# Altium schematic sheet AD5940PSTAT.SchDoc
size A; SheetNumber: 1; SheetTotal: 3
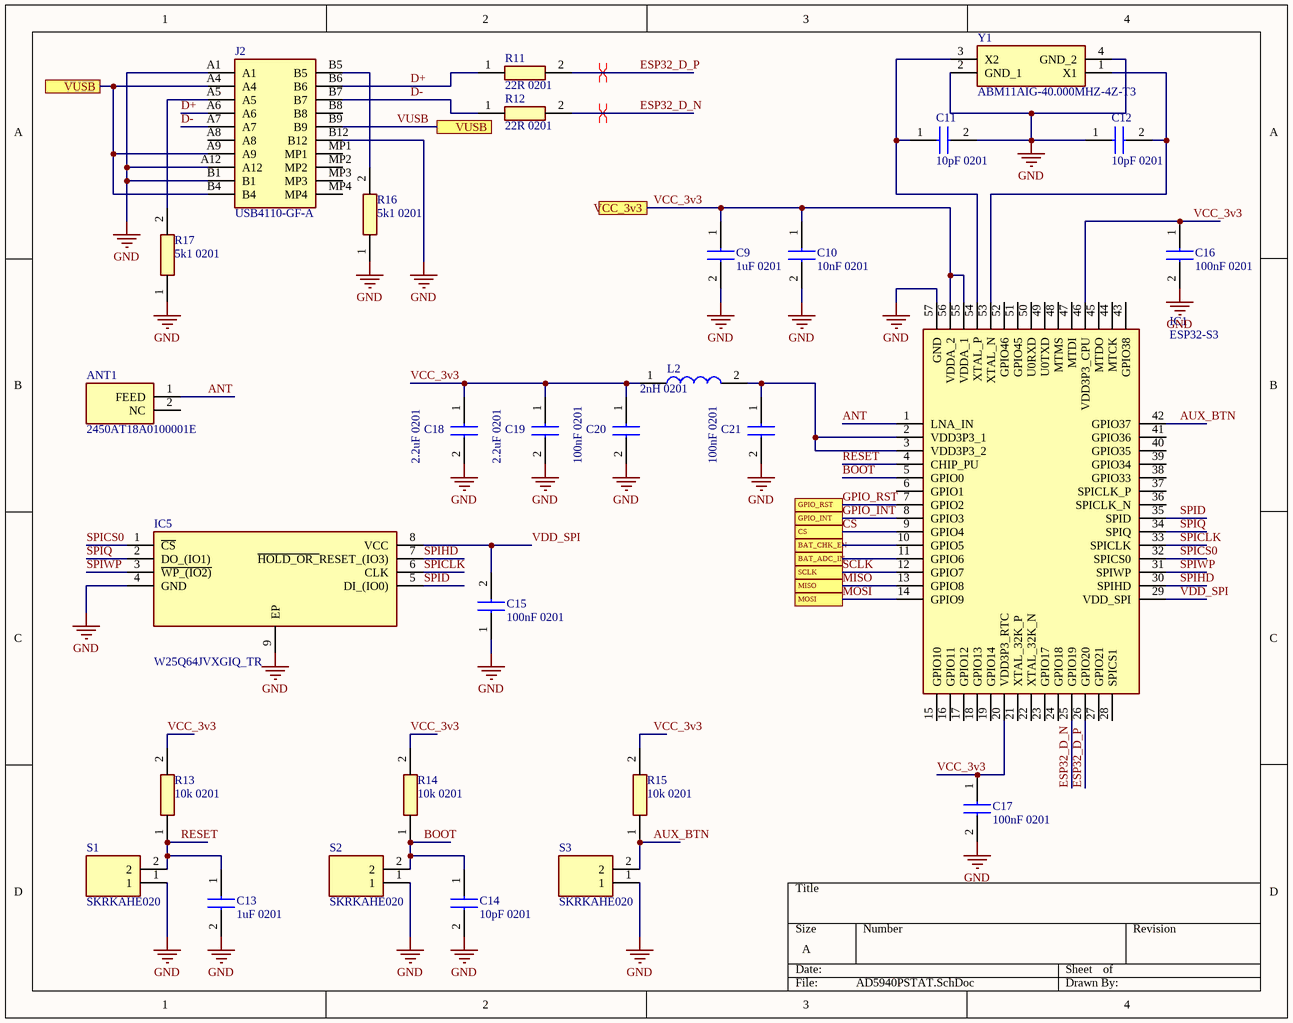
[diagram p0: AD5940PSTAT.SchDoc]

## Parts
ANT1  2450AT18A0100001E  [2450AT18A0100001E]
C9  1uF 0201  [CAPC0603X33N]
C10  10nF 0201  [CAPC0603X33N]
C11  10pF 0201  [CAPC0603X33N]
C12  10pF 0201  [CAPC0603X33N]
C13  1uF 0201  [CAPC0603X33N]
C14  10pF 0201  [CAPC0603X33N]
C15  100nF 0201  [CAPC0603X33N]
C16  100nF 0201  [CAPC0603X33N]
C17  100nF 0201  [CAPC0603X33N]
C18  2.2uF 0201  [CAPC0603X33N]
C19  2.2uF 0201  [CAPC0603X33N]
C20  100nF 0201  [CAPC0603X33N]
C21  100nF 0201  [CAPC0603X33N]
IC1  ESP32-S3  [QFN40P700X700X90-57N-D]
IC5  W25Q64JVXGIQ_TR  [SON80P400X400X50-9N]
J2  USB4110-GF-A  [USB4110GFA]
L2  2nH 0201  [LQP03TG3N1B02D]
R11  22R 0201  [RESC0603X28N]
R12  22R 0201  [RESC0603X28N]
R13  10k 0201  [RESC0603X28N]
R14  10k 0201  [RESC0603X28N]
R15  10k 0201  [RESC0603X28N]
R16  5k1 0201  [RESC0603X28N]
R17  5k1 0201  [RESC0603X28N]
S1  SKRKAHE020  [SKRKAEE020]
S2  SKRKAHE020  [SKRKAEE020]
S3  SKRKAHE020  [SKRKAEE020]
Y1  ABM11AIG-40.000MHZ-4Z-T3  [ABM11AIG16000MHZ81ZT]

## Ports
BAT_ADC_IN (see Battery_MGMT[4B]), BAT_CHK_EN (see Battery_MGMT[3B]), CS (see AD5940[4B]), GPIO_INT (see AD5940[4B]), GPIO_RST (see AD5940[4B]), MISO (see AD5940[4B]), MOSI (see AD5940[4B]), SCLK (see AD5940[4B]), VCC_3v3 (see Battery_MGMT[4C]), VUSB (see AD5940PSTAT[1A], Battery_MGMT[1C]), VUSB (see AD5940PSTAT[2A], Battery_MGMT[1C])

## Nets
GND: C9.2 C10.2 C11.2 C12.1 C13.2 C14.2 C15.1 C16.2 C17.2 C18.2 C19.2 C20.2 C21.2 IC1.57(GND) IC5.4(GND) IC5.9(EP) J2.A1 J2.A12 J2.B1 J2.B12 R16.1 R17.1 S1.1 S2.1 S3.1 Y1.2(GND_1) Y1.4(GND_2)
\: C14.1 IC1.5(GPIO0) R14.1 S2.2  [also labelled BOOT]
ANT: ANT1.1(FEED) IC1.1(LNA_IN)
AUX_BTN: IC1.42(GPIO37) R15.1 S3.2
BAT_ADC_IN: IC1.11(GPIO6) ; port BAT_ADC_IN
BAT_CHK_EN: IC1.10(GPIO5) ; port BAT_CHK_EN
CS: IC1.9(GPIO4) ; port CS
D+: J2.A6 J2.B6 R11.1
D-: J2.A7 J2.B7 R12.1
ESP32_D_N: IC1.25(GPIO19) R12.2
ESP32_D_P: IC1.26(GPIO20) R11.2
GPIO_INT: IC1.8(GPIO3) ; port GPIO_INT
GPIO_RST: IC1.7(GPIO2) ; port GPIO_RST
MISO: IC1.13(GPIO8) ; port MISO
MOSI: IC1.14(GPIO9) ; port MOSI
RESET: C13.1 IC1.4(CHIP_PU) R13.1 S1.2
SCLK: IC1.12(GPIO7) ; port SCLK
SPICLK: IC1.33(SPICLK) IC5.6(CLK)
SPICS0: IC1.32(SPICS0) IC5.1(~{CS})
SPID: IC1.35(SPID) IC5.5(DI_(IO0))
SPIHD: IC1.30(SPIHD) IC5.7(~{HOLD_OR_}RESET_(IO3))
SPIQ: IC1.34(SPIQ) IC5.2(DO_(IO1))
SPIWP: IC1.31(SPIWP) IC5.3(~{WP_(IO2)})
VCC_3v3: C9.1 C10.1 C16.1 C17.1 C18.1 C19.1 C20.1 IC1.20(VDD3P3_RTC) IC1.46(VDD3P3_CPU) IC1.55(VDDA_1) IC1.56(VDDA_2) L2.1 R13.2 R14.2 R15.2 ; port VCC_3v3
VDD_SPI: C15.2 IC1.29(VDD_SPI) IC5.8(VCC)
VUSB: J2.A4 J2.A9 J2.B4 J2.B9 ; port VUSB
NetC11_1: C11.1 IC1.54(XTAL_P) Y1.3(X2)
NetC12_2: C12.2 IC1.53(XTAL_N) Y1.1(X1)
NetC21_1: C21.1 IC1.2(VDD3P3_1) IC1.3(VDD3P3_2) L2.2
NetJ2_A5: J2.A5 R17.2
NetJ2_B5: J2.B5 R16.2

Not connected (* = marked no-connect by the designer): ANT1 2(NC); IC1 6(GPIO1) 15(GPIO10) 16(GPIO11) 17(GPIO12) 18(GPIO13) 19(GPIO14) 21(XTAL_32K_P) 22(XTAL_32K_N) 23(GPIO17) 24(GPIO18) 27(GPIO21) 28(SPICS1) 36(SPICLK_N) 37(SPICLK_P) 38(GPIO33) 39(GPIO34) 40(GPIO35) 41(GPIO36) 43(GPIO38) 44(MTCK) 45(MTDO) 47(MTDI) 48(MTMS) 49(U0TXD) 50(U0RXD) 51(GPIO45) 52(GPIO46); J2 A8 B8 MP1 MP2 MP3 MP4

## Layout directives
differential pair: ESP32_D_N, ESP32_D_P

## Library data of the parts
ANT1 = 2450AT18A0100001E: Antenna; Manufacturer_Name: JOHANSON TECHNOLOGY; Datasheet Link: https://www.johansontechnology.com/datasheets/2450AT18A100/2450AT18A100.pdf; Height: 1.4mm; Manufacturer_Part_Number: 2450AT18A0100001E
C9-C21 = 02013A0R5BAT2A: Capacitor; Manufacturer_Name: Kyocera AVX; Datasheet Link: http://www.mouser.com/catalog/supplier/library/pdf/AVXSurfaceMountCeramic.pdf; Height: 0.33mm; Manufacturer_Part_Number: 02013A0R5BAT2A; Mouser Part Number: 581-02013A0R5BAT2A; Mouser Price/Stock: https://www.mouser.co.uk/ProductDetail/KYOCERA-AVX/02013A0R5BAT2A?qs=Thry1QCnmXDPtFIq9lj3NA%3D%3D
IC1 = ESP32-S3: Integrated Circuit; Manufacturer_Name: Espressif Systems; Datasheet Link: https://nl.mouser.com/datasheet/2/891/Espressif_ESP32_S3_Datasheet-2904763.pdf; Height: 0.9mm; Manufacturer_Part_Number: ESP32-S3; Mouser Part Number: 356-ESP32-S3; Mouser Price/Stock: https://www.mouser.co.uk/ProductDetail/Espressif-Systems/ESP32-S3?qs=Rp5uXu7WBW%2FNWuUy%252BBihNw%3D%3D
IC5 = W25Q64JVXGIQ_TR: Integrated Circuit; Manufacturer_Name: Winbond; Manufacturer_Part_Number: W25Q64JVXGIQ TR; Datasheet Link: https://www.mouser.com/datasheet/2/949/w25q64jv_revj_03272018_plus-1489671.pdf; Height: 0.5mm; Mouser Part Number: 454-W25Q64JVXGIQTR; Mouser Price/Stock: https://www.mouser.co.uk/ProductDetail/Winbond/W25Q64JVXGIQ-TR?qs=qSfuJ%252Bfl%2Fd5kgMLGcal3yA%3D%3D; Arrow Part Number: W25Q64JVXGIQ TR; Arrow Price/Stock: https://www.arrow.com/en/products/w25q64jvxgiqtr/winbond-electronics?utm_currency=USD&region=nac
J2 = USB4110-GF-A: Connector; Manufacturer_Name: GCT (GLOBAL CONNECTOR TECHNOLOGY); Datasheet Link: https://gct.co/files/drawings/usb4110.pdf; Height: 3.26mm; Manufacturer_Part_Number: USB4110-GF-A; Mouser Part Number: 640-USB4110-GF-A; Mouser Price/Stock: https://www.mouser.co.uk/ProductDetail/GCT/USB4110-GF-A?qs=KUoIvG%2F9IlYiZvIXQjyJeA%3D%3D
L2 = LQP03TN2N0C02D: Inductor; Manufacturer_Name: Murata Electronics; Datasheet Link: https://search.murata.co.jp/Ceramy/image/img/P02/JELF243C-0015.pdf; Height: 0.33mm; Manufacturer_Part_Number: LQP03TN2N0C02D; Mouser Part Number: 81-LQP03TN2N0C02D; Mouser Price/Stock: https://www.mouser.co.uk/ProductDetail/Murata-Electronics/LQP03TN2N0C02D?qs=e%252BE4OD6MgMf9XeFWsUHDiQ%3D%3D; Arrow Part Number: LQP03TN2N0C02D; Arrow Price/Stock: https://www.arrow.com/en/products/lqp03tn2n0c02d/murata-manufacturing?region=nac
R11-R17 = CPF0201D422RE1: Resistor; Manufacturer_Name: TE Connectivity; Datasheet Link: http://www.te.com/commerce/DocumentDelivery/DDEController?Action=showdoc&DocId=Data+Sheet%7F1773200-1%7FA%7Fpdf%7FEnglish%7FENG_DS_1773200-1_A.pdf%7F4-2176215-6; Height: 0.28mm; Manufacturer_Part_Number: CPF0201D422RE1
S1-S3 = SKRKAHE020: Switch; Manufacturer_Name: ALPS Electric; Datasheet Link: https://www.alps.com/prod/info/E/HTML/Tact/SurfaceMount/SKRK/SKRKAHE020.html; Height: 2mm; Manufacturer_Part_Number: SKRKAHE020; Mouser Part Number: 688-SKRKAHE010; Mouser Price/Stock: https://www.mouser.co.uk/ProductDetail/Alps-Alpine/SKRKAHE020?qs=chTDxNqvsymUfAVYmcFXaw%3D%3D
Y1 = ABM11AIG-40.000MHZ-4Z-T3: Crystal or Oscillator; Manufacturer_Name: ABRACON; Datasheet Link: https://abracon.com/AIGcrystals/ABM11AIG.pdf; Height: 0.55mm; Manufacturer_Part_Number: ABM11AIG-40.000MHZ-4Z-T3; Mouser Part Number: 815-M11AIG-40-4ZT3; Mouser Price/Stock: https://www.mouser.com/Search/Refine.aspx?Keyword=815-M11AIG-40-4ZT3